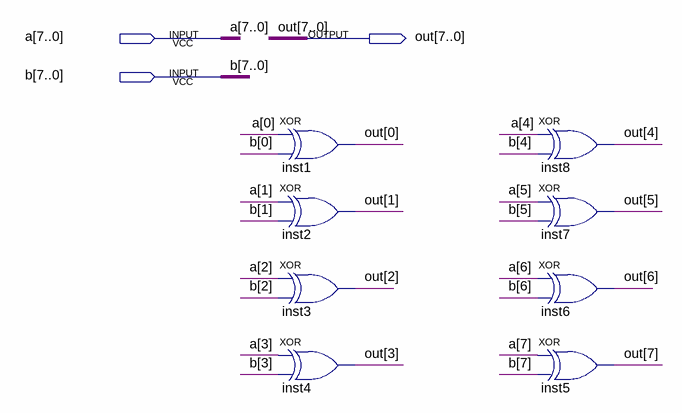
[diagram p0: schematic sheet]
// Quartus schematic xor_gate.bdf as structural Verilog: 8 symbols, 3 pins
module xor_gate (
  input  [7:0] a,
  input  [7:0] b,
  output [7:0] out
);

  xor inst1 (out[0], a[0], b[0]);
  xor inst2 (out[1], a[1], b[1]);
  xor inst3 (out[2], a[2], b[2]);
  xor inst4 (out[3], a[3], b[3]);
  xor inst8 (out[4], a[4], b[4]);
  xor inst7 (out[5], a[5], b[5]);
  xor inst6 (out[6], a[6], b[6]);
  xor inst5 (out[7], a[7], b[7]);
endmodule
